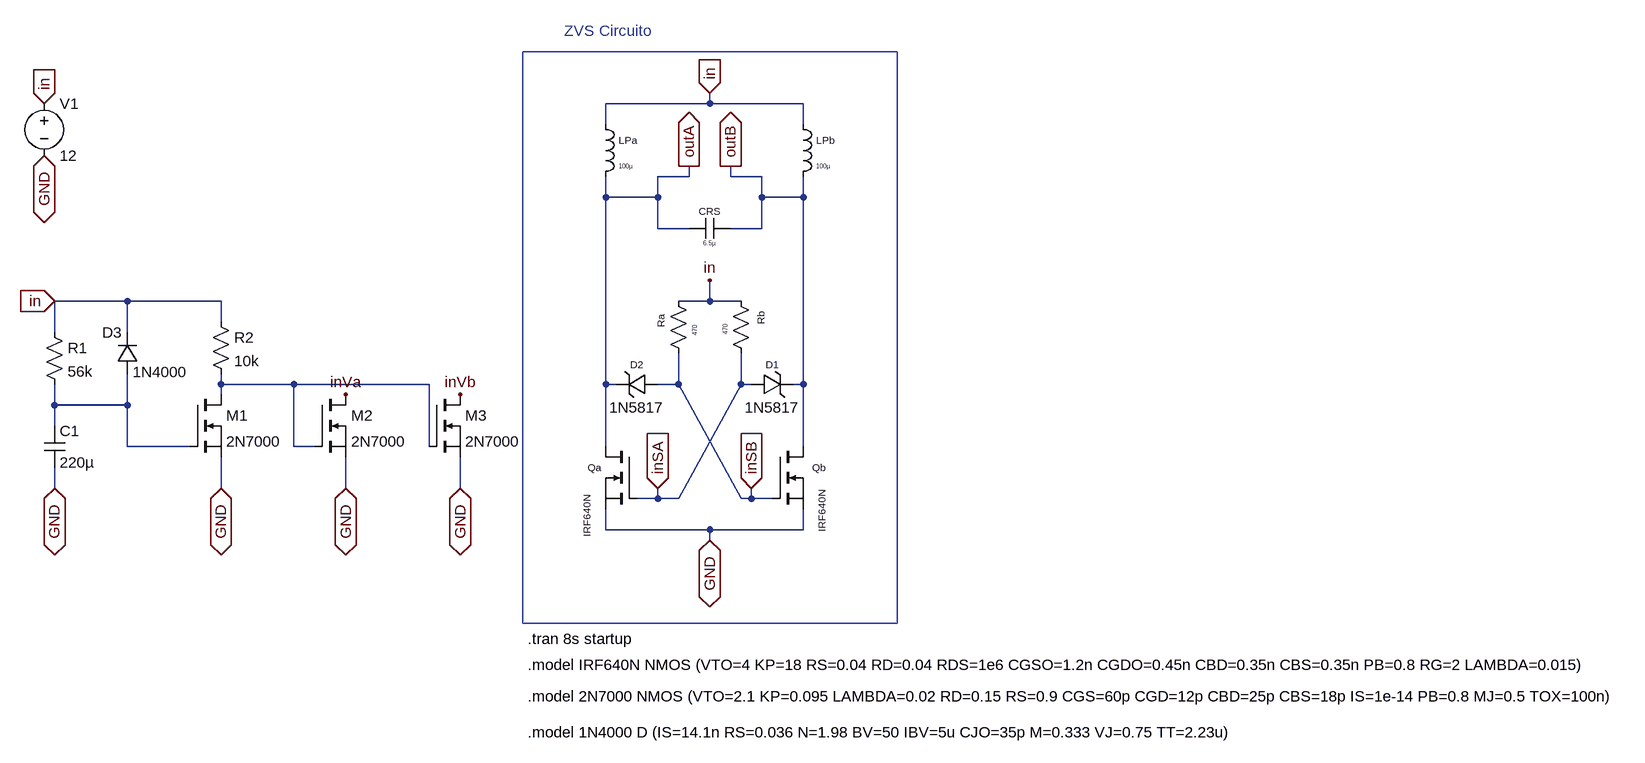
[diagram p0: schematic zns.asc]
zns.asc, the LTspice schematic file:
Version 4.1
SHEET 1 1816 920
WIRE 304 -64 304 -80
WIRE 304 -64 144 -64
WIRE 448 -64 304 -64
WIRE 144 -32 144 -64
WIRE 448 -32 448 -64
WIRE 272 48 272 32
WIRE 272 48 224 48
WIRE 336 48 336 32
WIRE 384 48 336 48
WIRE 144 80 144 48
WIRE 224 80 224 48
WIRE 224 80 144 80
WIRE 384 80 384 48
WIRE 448 80 448 48
WIRE 448 80 384 80
WIRE 224 128 224 80
WIRE 272 128 224 128
WIRE 384 128 384 80
WIRE 384 128 336 128
WIRE -592 240 -704 240
WIRE -448 240 -592 240
WIRE 304 240 304 208
WIRE 304 240 256 240
WIRE 352 240 304 240
WIRE -448 272 -448 240
WIRE -704 288 -704 240
WIRE -592 288 -592 240
WIRE -448 368 -448 352
WIRE -336 368 -448 368
WIRE -128 368 -336 368
WIRE 144 368 144 80
WIRE 160 368 144 368
WIRE 256 368 256 320
WIRE 256 368 224 368
WIRE 352 368 352 320
WIRE 368 368 352 368
WIRE 448 368 448 80
WIRE 448 368 432 368
WIRE -448 384 -448 368
WIRE -704 400 -704 368
WIRE -592 400 -592 352
WIRE -592 400 -704 400
WIRE -704 432 -704 400
WIRE -592 464 -592 400
WIRE -496 464 -592 464
WIRE -336 464 -336 368
WIRE -304 464 -336 464
WIRE -128 464 -128 368
WIRE 144 464 144 368
WIRE 448 464 448 368
WIRE -704 528 -704 496
WIRE -448 528 -448 480
WIRE -256 528 -256 480
WIRE -80 528 -80 480
WIRE 224 544 224 528
WIRE 224 544 192 544
WIRE 256 544 352 368
WIRE 256 544 224 544
WIRE 352 544 256 368
WIRE 368 544 368 528
WIRE 368 544 352 544
WIRE 400 544 368 544
WIRE 144 592 144 560
WIRE 304 592 144 592
WIRE 448 592 448 560
WIRE 448 592 304 592
WIRE 304 608 304 592
FLAG 304 208 in
FLAG 304 -80 in
IOPIN 304 -80 In
FLAG 304 608 GND
IOPIN 304 608 BiDir
FLAG 272 32 outA
IOPIN 272 32 Out
FLAG 336 32 outB
IOPIN 336 32 Out
FLAG -704 240 in
IOPIN -704 240 In
FLAG -704 528 GND
IOPIN -704 528 BiDir
FLAG -720 16 GND
IOPIN -720 16 BiDir
FLAG -720 -64 in
IOPIN -720 -64 In
FLAG 224 528 inSA
IOPIN 224 528 In
FLAG 368 528 inSB
IOPIN 368 528 In
FLAG -448 528 GND
IOPIN -448 528 BiDir
FLAG -256 528 GND
IOPIN -256 528 BiDir
FLAG -80 528 GND
IOPIN -80 528 BiDir
FLAG -256 384 inVa
FLAG -80 384 inVb
DATAFLAG -432 368 ""
SYMBOL cap 336 112 R90
WINDOW 0 0 32 VBottom 1
WINDOW 3 32 32 VTop 0
SYMATTR InstName CRS
SYMATTR Value 6.5µ
SYMBOL ind 128 -48 R0
WINDOW 0 36 40 Left 1
WINDOW 3 36 80 Left 0
SYMATTR InstName LPa
SYMATTR Value 100µ
SYMATTR SpiceLine Rser=1m
SYMBOL ind 432 -48 R0
WINDOW 0 36 40 Left 1
WINDOW 3 36 80 Left 0
SYMATTR InstName LPb
SYMATTR Value 100µ
SYMATTR SpiceLine Rser=1m
SYMBOL res 240 224 R0
WINDOW 0 -11 47 VCenter 1
WINDOW 3 41 70 VLeft 0
SYMATTR InstName Ra
SYMATTR Value 470
SYMBOL res 336 224 R0
WINDOW 0 47 42 VCenter 1
WINDOW 3 -8 68 VLeft 0
SYMATTR InstName Rb
SYMATTR Value 470
SYMBOL nmos 400 464 R0
WINDOW 0 72 32 Center 1
WINDOW 3 77 100 VCenter 1
SYMATTR InstName Qb
SYMATTR Value IRF640N
SYMBOL zener 368 384 R270
WINDOW 0 36 32 VTop 1
WINDOW 3 -4 32 VBottom 2
SYMATTR InstName D1
SYMATTR Value 1N5817
SYMBOL zener 224 352 R90
WINDOW 0 -4 32 VBottom 1
WINDOW 3 36 32 VTop 2
SYMATTR InstName D2
SYMATTR Value 1N5817
SYMBOL nmos 192 464 M0
WINDOW 0 65 32 Center 1
WINDOW 3 77 107 VCenter 1
SYMATTR InstName Qa
SYMATTR Value IRF640N
SYMBOL res -720 272 R0
SYMATTR InstName R1
SYMATTR Value 56k
SYMBOL cap -720 432 R0
SYMATTR InstName C1
SYMATTR Value 220µ
SYMBOL res -464 256 R0
SYMATTR InstName R2
SYMATTR Value 10k
SYMBOL voltage -720 -80 R0
WINDOW 123 0 0 Left 0
WINDOW 39 0 0 Left 0
SYMATTR InstName V1
SYMATTR Value 12
SYMBOL nmos -496 384 R0
SYMATTR InstName M1
SYMATTR Value 2N7000
SYMBOL nmos -304 384 R0
SYMATTR InstName M2
SYMATTR Value 2N7000
SYMBOL nmos -128 384 R0
SYMATTR InstName M3
SYMATTR Value 2N7000
SYMBOL diode -576 352 R180
WINDOW 0 24 64 Left 2
WINDOW 3 -77 3 Left 2
SYMATTR InstName D3
SYMATTR Value 1N4000
TEXT 80 -176 Left 2 ;ZVS Circuito
TEXT 24 760 Left 2 !.tran 8s startup
TEXT 24 800 Left 2 !.model IRF640N NMOS (VTO=4 KP=18 RS=0.04 RD=0.04 RDS=1e6 CGSO=1.2n CGDO=0.45n CBD=0.35n CBS=0.35n PB=0.8 RG=2 LAMBDA=0.015)
TEXT 24 848 Left 2 !.model 2N7000 NMOS (VTO=2.1 KP=0.095 LAMBDA=0.02 RD=0.15 RS=0.9 CGS=60p CGD=12p CBD=25p CBS=18p IS=1e-14 PB=0.8 MJ=0.5 TOX=100n)
TEXT 24 904 Left 2 !.model 1N4000 D (IS=14.1n RS=0.036 N=1.98 BV=50 IBV=5u CJO=35p M=0.333 VJ=0.75 TT=2.23u)
RECTANGLE Normal 592 736 16 -144

The netlist it stands for:
* zns.asc
CRS outB outA 6.5µ
LPa in outA 100µ Rser=1m
LPb in outB 100µ Rser=1m
Ra in inSB 470
Rb in inSA 470
M§Qb outB inSB GND GND IRF640N
D1 inSA outB 1N5817
D2 inSB outA 1N5817
M§Qa outA inSA GND GND IRF640N
R1 in N002 56k
C1 N002 GND 220µ
R2 in N001 10k
V1 in GND 12
M1 N001 N002 GND GND 2N7000
M2 inVa N001 GND GND 2N7000
M3 inVb N001 GND GND 2N7000
D3 N002 in 1N4000
.model D D
.lib standard.dio
.model NMOS NMOS
.model PMOS PMOS
.lib standard.mos
* ZVS Circuito
.tran 8s startup
.model IRF640N NMOS (VTO=4 KP=18 RS=0.04 RD=0.04 RDS=1e6 CGSO=1.2n CGDO=0.45n CBD=0.35n CBS=0.35n PB=0.8 RG=2 LAMBDA=0.015)
.model 2N7000 NMOS (VTO=2.1 KP=0.095 LAMBDA=0.02 RD=0.15 RS=0.9 CGS=60p CGD=12p CBD=25p CBS=18p IS=1e-14 PB=0.8 MJ=0.5 TOX=100n)
.model 1N4000 D (IS=14.1n RS=0.036 N=1.98 BV=50 IBV=5u CJO=35p M=0.333 VJ=0.75 TT=2.23u)
.backanno
.end